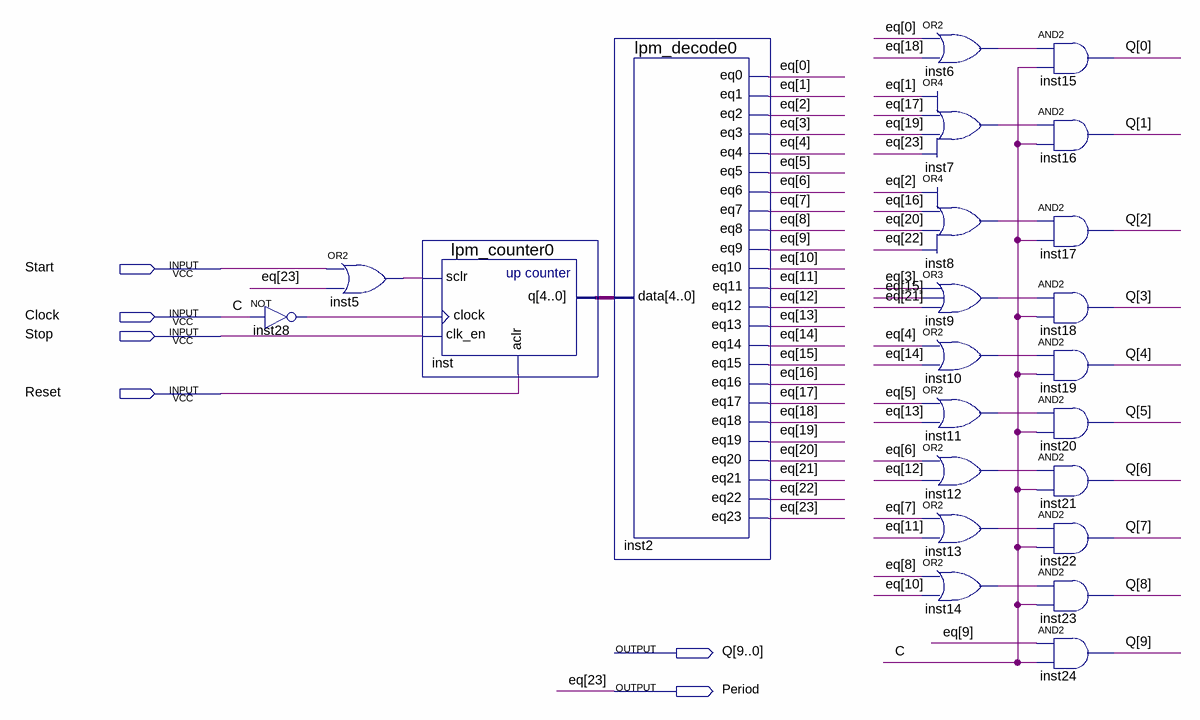
[diagram p0: schematic sheet]
// Quartus schematic decoder.bdf as structural Verilog: 23 symbols, 6 pins
module decoder (
  input  Start,
  input  Clock,
  input  Stop,
  input  Reset,
  output [9:0] Q,
  output Period
);

  wire inst5_out, inst6_out, inst7_out, inst8_out, inst9_out, inst10_out, inst11_out, inst12_out, inst13_out,
       inst14_out, inst28_out;
  wire [4:0] inst_q;
  wire [22:0] eq;

  not inst28 (inst28_out, Clock);
  or inst5 (inst5_out, Start, Period);
  lpm_counter0 inst (.sclr(inst5_out), .clock(inst28_out), .clk_en(Stop), .aclr(Reset), .q(inst_q));
  lpm_decode0 inst2 (
    .data(inst_q), .eq0(eq[0]), .eq1(eq[1]), .eq2(eq[2]), .eq3(eq[3]), .eq4(eq[4]), .eq5(eq[5]), .eq6(eq[6]),
    .eq7(eq[7]), .eq8(eq[8]), .eq9(eq[9]), .eq10(eq[10]), .eq11(eq[11]), .eq12(eq[12]), .eq13(eq[13]),
    .eq14(eq[14]), .eq15(eq[15]), .eq16(eq[16]), .eq17(eq[17]), .eq18(eq[18]), .eq19(eq[19]), .eq20(eq[20]),
    .eq21(eq[21]), .eq22(eq[22]), .eq23(Period));
  or inst6 (inst6_out, eq[0], eq[18]);
  or inst7 (inst7_out, eq[1], eq[17], eq[19], Period);
  or inst8 (inst8_out, eq[2], eq[16], eq[20], eq[22]);
  or inst9 (inst9_out, eq[3], eq[15], eq[21]);
  or inst10 (inst10_out, eq[4], eq[14]);
  or inst11 (inst11_out, eq[5], eq[13]);
  or inst12 (inst12_out, eq[6], eq[12]);
  or inst13 (inst13_out, eq[7], eq[11]);
  or inst14 (inst14_out, eq[8], eq[10]);
  and inst15 (Q[0], inst6_out, Clock);
  and inst16 (Q[1], inst7_out, Clock);
  and inst17 (Q[2], inst8_out, Clock);
  and inst18 (Q[3], inst9_out, Clock);
  and inst19 (Q[4], inst10_out, Clock);
  and inst20 (Q[5], inst11_out, Clock);
  and inst21 (Q[6], inst12_out, Clock);
  and inst22 (Q[7], inst13_out, Clock);
  and inst23 (Q[8], inst14_out, Clock);
  and inst24 (Q[9], eq[9], Clock);

  // Other names for the same wires on the sheet: C = Clock; eq[23] = Period
endmodule
